# Altium project Keyboard.PrjPcb
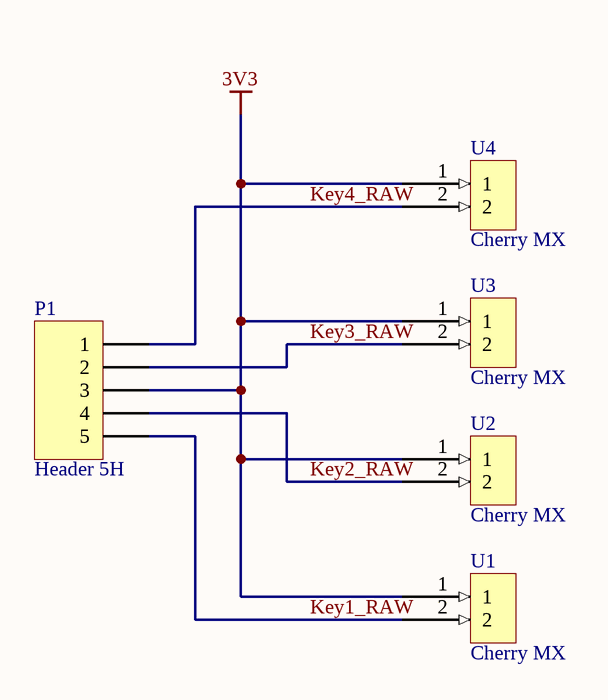
[diagram p0: keyboard_schem.SchDoc]
1 sheet, 5 parts. Net scope: global (net labels, ports and power ports of the same name join across sheets).
Board file: keyboard_pcb.PcbDoc

## Sheet keyboard_schem.SchDoc
size A; SheetNumber: 1; SheetTotal: 1

### Parts
P1  Header 5H  [HDR1X5H]
U1  Cherry MX  [Cherry MX-Footprint-1]
U2  Cherry MX  [Cherry MX-Footprint-1]
U3  Cherry MX  [Cherry MX-Footprint-1]
U4  Cherry MX  [Cherry MX-Footprint-1]

### Nets
3V3: P1.3 U1.1 U2.1 U3.1 U4.1
Key1_RAW: P1.5 U1.2
Key2_RAW: P1.4 U2.2
Key3_RAW: P1.2 U3.2
Key4_RAW: P1.1 U4.2

### Library data of the parts
P1 = Header 5H: Header, 5-Pin, Right Angle; LatestRevisionDate: 17-Jul-2002; LatestRevisionNote: Re-released for DXP Platform.; Publisher: Altium Limited
U1-U4 = CMP-011-00015-1: Footprint for PCB mounted Cherry MX switch